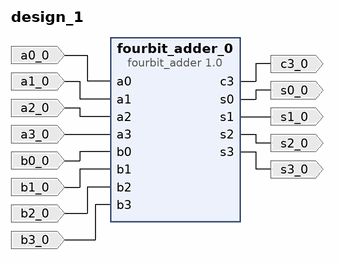
[diagram p0: block diagram of the top level]
# Vivado block design design_1, xc7a100tcsg324-1, Vivado 2023.2
create_bd_design design_1

create_bd_port -dir I -type data a0_0
create_bd_port -dir I -type data a1_0
create_bd_port -dir I -type data a2_0
create_bd_port -dir I -type data a3_0
create_bd_port -dir I -type data b0_0
create_bd_port -dir I -type data b1_0
create_bd_port -dir I -type data b2_0
create_bd_port -dir I -type data b3_0
create_bd_port -dir O -type data c3_0
create_bd_port -dir O -type data s0_0
create_bd_port -dir O -type data s1_0
create_bd_port -dir O -type data s2_0
create_bd_port -dir O -type data s3_0

create_bd_cell -type ip -vlnv xilinx.com:hls:fourbit_adder:1.0 fourbit_adder_0

# ---- connections ----

connect_bd_net -net a0_0_1 [get_bd_ports a0_0] [get_bd_pins fourbit_adder_0/a0]
connect_bd_net -net a1_0_1 [get_bd_ports a1_0] [get_bd_pins fourbit_adder_0/a1]
connect_bd_net -net a2_0_1 [get_bd_ports a2_0] [get_bd_pins fourbit_adder_0/a2]
connect_bd_net -net a3_0_1 [get_bd_ports a3_0] [get_bd_pins fourbit_adder_0/a3]
connect_bd_net -net b0_0_1 [get_bd_ports b0_0] [get_bd_pins fourbit_adder_0/b0]
connect_bd_net -net b1_0_1 [get_bd_ports b1_0] [get_bd_pins fourbit_adder_0/b1]
connect_bd_net -net b2_0_1 [get_bd_ports b2_0] [get_bd_pins fourbit_adder_0/b2]
connect_bd_net -net b3_0_1 [get_bd_ports b3_0] [get_bd_pins fourbit_adder_0/b3]
connect_bd_net [get_bd_pins fourbit_adder_0/c3] [get_bd_ports c3_0]
connect_bd_net [get_bd_pins fourbit_adder_0/s0] [get_bd_ports s0_0]
connect_bd_net [get_bd_pins fourbit_adder_0/s1] [get_bd_ports s1_0]
connect_bd_net [get_bd_pins fourbit_adder_0/s2] [get_bd_ports s2_0]
connect_bd_net [get_bd_pins fourbit_adder_0/s3] [get_bd_ports s3_0]

validate_bd_design
save_bd_design
